# Altium project UltraZOhm_CarrierBoard.PrjPcb (part 8 of 8)
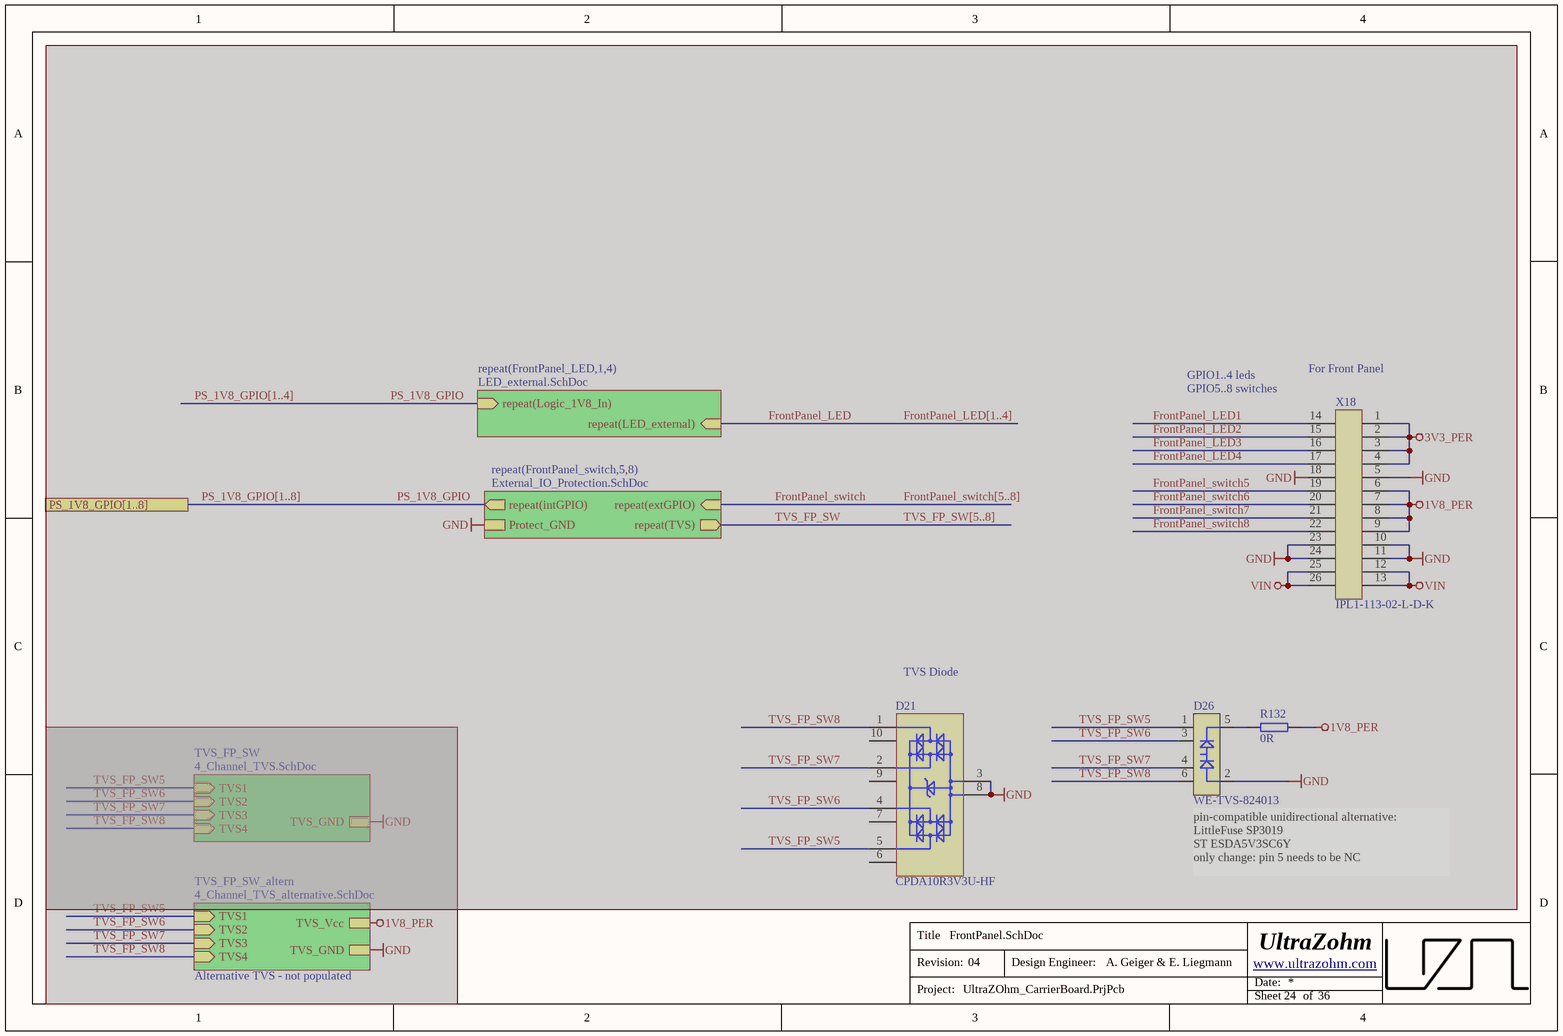
[diagram p130: FrontPanel.SchDoc]

## Assembly variants
Standard: not fitted D8 D9 D13 D26 P1A P1B R1H R19 R26 R27 R34 R36 R38 R40 R42 R44 R46 R47 R48L R75A R75B R75C R75D R75E R78A R78B R79A R79B R84 R85 R89 R96 R97H R98 R100 R101 R102 R103 R104 R105 R106 R107 R108 R109 R110 R122L R123H R124L R125L R132 R137 R139Y R154 R155 R157LA R157LB R157LC R158LA R158LB R158LC R159HA R159HB R159HC R160HA R160HB R160HC R176 R177 R178 R179 R180 R181 R182 R183 R184 R185 R186 R187 R188 R189 R190 R191 R192 R193L R194L R195L R196L R200A R200B R207Y R208 R218 R221 R223 R226 R227 R228 X9 X11
B: not fitted D8 D9 D13 D26 P1A P1B R1H R19 R26 R27 R34 R36 R38 R40 R42 R44 R46 R47 R48L R75A R75B R75C R75D R75E R78A R78B R79A R79B R84 R85 R89 R96 R97H R98 R100 R101 R102 R103 R104 R105 R106 R107 R108 R109 R110 R122L R123H R124L R125L R132 R137 R139Y R154 R155 R157LA R157LB R157LC R158LA R158LB R158LC R159HA R159HB R159HC R160HA R160HB R160HC R176 R177 R178 R179 R180 R181 R182 R183 R184 R185 R186 R187 R188 R189 R190 R191 R192 R193L R194L R195L R196L R200A R200B R207Y R208 R218 R221 R223 R226 R227 R228 X9 X11; alternate parts X4 -> 30864, U10 -> 30863, U11 -> 30863, U12 -> 30863, X7A -> 30866, X12 -> 30865, X7B -> 30866, X10 -> 30867, X18 -> 30869, X2 -> 30864
C: not fitted D8 D9 D13 D26 P1A P1B R1H R19 R26 R27 R34 R36 R38 R40 R42 R44 R46 R47 R48L R75A R75B R75C R75D R75E R78A R78B R79A R79B R84 R85 R89 R96 R97H R98 R100 R101 R102 R103 R104 R105 R106 R107 R108 R109 R110 R122L R123H R124L R125L R132 R137 R139Y R154 R155 R157LA R157LB R157LC R158LA R158LB R158LC R159HA R159HB R159HC R160HA R160HB R160HC R176 R177 R178 R179 R180 R181 R182 R183 R184 R185 R186 R187 R188 R189 R190 R191 R192 R193L R194L R195L R196L R200A R200B R207Y R208 R218 R221 R223 R226 R227 R228 X9 X11; alternate parts X4 -> 30864, U10 -> 30863, U11 -> 30863, U12 -> 30863, X2 -> 30864
S001: not fitted D8 D9 D13 D26 P1A P1B R1H R19 R26 R27 R34 R36 R38 R40 R42 R44 R46 R47 R48L R75A R75B R75C R75D R75E R78A R78B R79A R79B R84 R85 R89 R96 R97H R98 R100 R101 R102 R103 R104 R105 R106 R107 R108 R109 R110 R122L R123H R124L R125L R132 R137 R139Y R154 R155 R157LA R157LB R157LC R158LA R158LB R158LC R159HA R159HB R159HC R160HA R160HB R160HC R176 R177 R178 R179 R180 R181 R182 R183 R184 R185 R186 R187 R188 R189 R190 R191 R192 R193L R194L R195L R196L R200A R200B R207Y R208 R218 R221 R223 R226 R227 R228 U9A U9B U21 U29 X9 X11; alternate parts X4 -> 30864, U10 -> 30863, U11 -> 30863, U12 -> 30863, X2 -> 30864, U18 -> 31526, U24A -> 31527, U24B -> 31527, U24C -> 31527, U17 -> 31504, U25A -> 31504, U25C -> 31504, U25B -> 31504, U31 -> 31504, U14 -> 31505, U30 -> 31505, U4A -> 31885, U4B -> 31885, U4C -> 31885, U4D -> 31885, U4E -> 31885
S002: not fitted D8 D9 D13 D26 P1A P1B R1H R19 R26 R27 R34 R36 R38 R40 R42 R44 R46 R47 R48L R75A R75B R75C R75D R75E R78A R78B R79A R79B R84 R85 R89 R96 R97H R98 R100 R101 R102 R103 R104 R105 R106 R107 R108 R109 R110 R122L R123H R124L R125L R132 R137 R139Y R154 R155 R157LA R157LB R157LC R158LA R158LB R158LC R159HA R159HB R159HC R160HA R160HB R160HC R176 R177 R178 R179 R180 R181 R182 R183 R184 R185 R186 R187 R188 R189 R190 R191 R192 R193L R194L R195L R196L R200A R200B R207Y R208 R218 R221 R223 R226 R227 R228 X9 X11; alternate parts X4 -> 30864, X2 -> 30864, U18 -> 31501, U24A -> 31502, U24B -> 31502, U24C -> 31502, U17 -> 31504, U25A -> 31504, U25C -> 31504, U25B -> 31504, U31 -> 31504, U14 -> 31505, U30 -> 31505, U4A -> 31885, U4B -> 31885, U4C -> 31885, U4D -> 31885, U4E -> 31885, U7A -> 31706, U7B -> 31706, U9A -> 31503, U9B -> 31503, U10 -> 30863, U11 -> 30863, U12 -> 30863, U19 -> 31706, U21 -> 31503, U27 -> 31706, U29 -> 31503
S003: not fitted D8 D9 D13 D26 P1A P1B R1H R19 R26 R27 R34 R36 R38 R40 R42 R44 R46 R47 R48L R75A R75B R75C R75D R75E R78A R78B R79A R79B R84 R85 R89 R96 R97H R98 R100 R101 R102 R103 R104 R105 R106 R107 R108 R109 R110 R122L R123H R124L R125L R132 R137 R139Y R154 R155 R157LA R157LB R157LC R158LA R158LB R158LC R159HA R159HB R159HC R160HA R160HB R160HC R176 R177 R178 R179 R180 R181 R182 R183 R184 R185 R186 R187 R188 R189 R190 R191 R192 R193L R194L R195L R196L R200A R200B R207Y R208 R218 R221 R223 R226 R227 R228 X9 X11; alternate parts X4 -> 30864, X2 -> 30864, U18 -> 33201, U24A -> 31502, U24B -> 31502, U24C -> 31502, U17 -> 31504, U25A -> 31504, U25C -> 31504, U25B -> 31504, U31 -> 31504, U14 -> 33202, U30 -> 33202, U4A -> 31885, U4B -> 31885, U4C -> 31885, U4D -> 31885, U4E -> 31885, U7A -> 31706, U7B -> 31706, U9A -> 33200, U9B -> 33200, U10 -> 30863, U11 -> 30863, U12 -> 30863, U19 -> 31706, U21 -> 33200, U27 -> 31706, U29 -> 33200, R210 -> 21492, R230 -> 21492